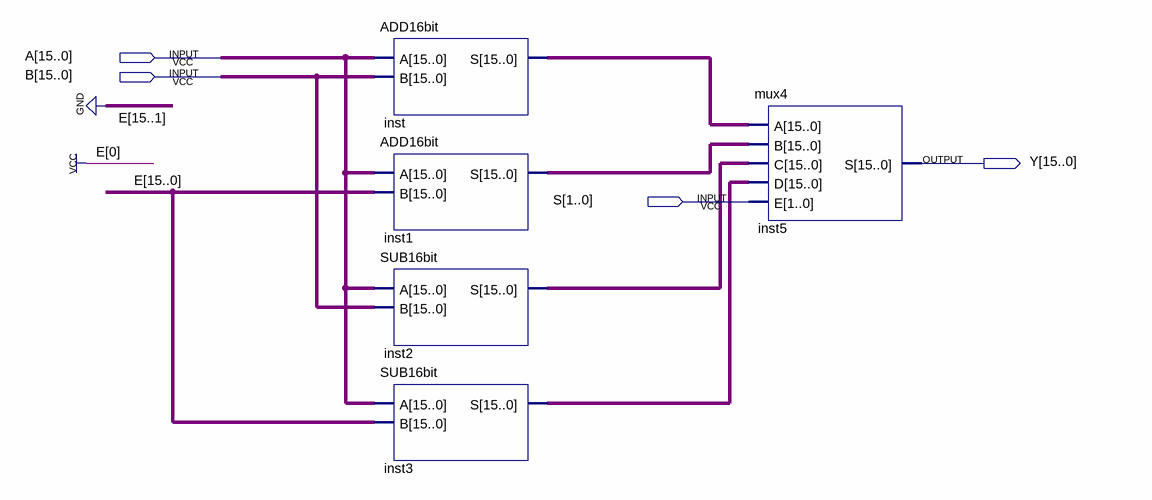
[diagram p0: schematic sheet]
// Quartus schematic AU.bdf as structural Verilog: 5 symbols, 4 pins
module AU (
  input  [15:0] A,
  input  [15:0] B,
  input  [1:0] S,
  output [15:0] Y
);

  wire [15:0] inst1_s, inst2_s, inst3_s, inst_s;

  ADD16bit inst (.A(A), .B(B), .S(inst_s));
  ADD16bit inst1 (.A(A), .B(16'b0000000000000001), .S(inst1_s));
  SUB16bit inst2 (.A(A), .B(B), .S(inst2_s));
  SUB16bit inst3 (.A(A), .B(16'b0000000000000001), .S(inst3_s));
  mux4 inst5 (.A(inst_s), .B(inst1_s), .C(inst2_s), .D(inst3_s), .E(S), .S(Y));
endmodule
